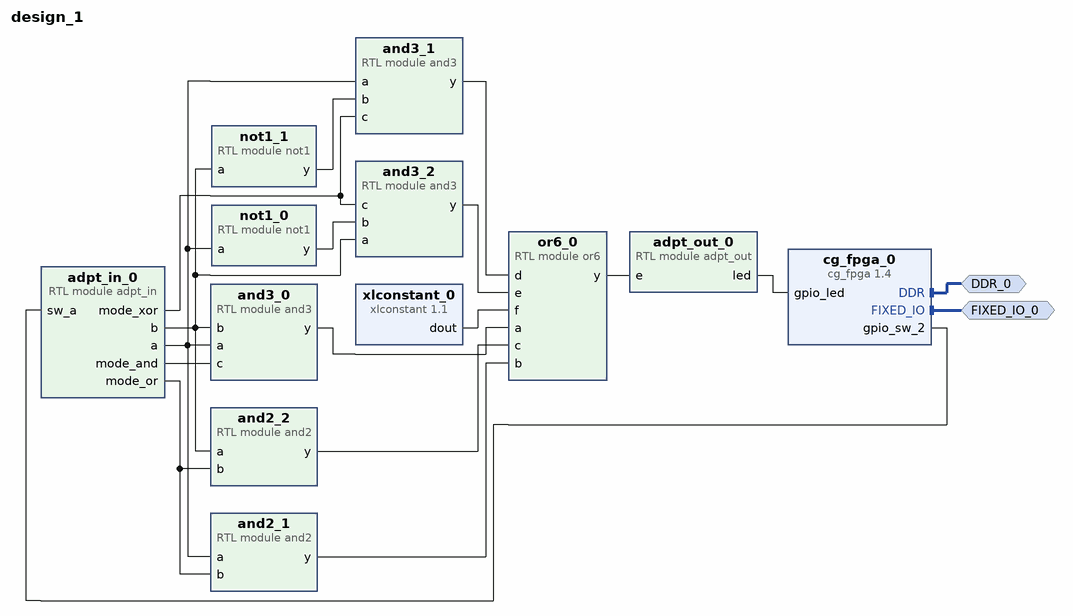
[diagram p0: block diagram of the top level]
# Vivado block design design_1, xc7z020clg400-1, Vivado 2025.2
create_bd_design design_1

create_bd_intf_port -mode Master -vlnv xilinx.com:display_processing_system7:fixedio_rtl:1.0 FIXED_IO_0
create_bd_intf_port -mode Master -vlnv xilinx.com:interface:ddrx_rtl:1.0 DDR_0

create_bd_cell -type ip -vlnv educg.net:user:cg_fpga:1.4 cg_fpga_0
create_bd_cell -type module -reference adpt_in adpt_in_0
create_bd_cell -type module -reference not1 not1_0
create_bd_cell -type module -reference not1 not1_1
create_bd_cell -type module -reference and2 and2_1
create_bd_cell -type module -reference and2 and2_2
create_bd_cell -type module -reference or6 or6_0
create_bd_cell -type module -reference adpt_out adpt_out_0
create_bd_cell -type module -reference and3 and3_0
create_bd_cell -type module -reference and3 and3_1
create_bd_cell -type module -reference and3 and3_2
create_bd_cell -type ip -vlnv xilinx.com:ip:xlconstant:1.1 xlconstant_0
set_property -dict {CONFIG.CONST_VAL 0} [get_bd_cells xlconstant_0]

# ---- connections ----

connect_bd_intf_net [get_bd_intf_ports DDR_0] [get_bd_intf_pins cg_fpga_0/DDR]
connect_bd_intf_net [get_bd_intf_ports FIXED_IO_0] [get_bd_intf_pins cg_fpga_0/FIXED_IO]
connect_bd_net [get_bd_pins adpt_in_0/a] [get_bd_pins not1_0/a] [get_bd_pins and3_0/a] [get_bd_pins and2_1/a] [get_bd_pins and3_1/a]
connect_bd_net [get_bd_pins adpt_in_0/b] [get_bd_pins not1_1/a] [get_bd_pins and2_2/a] [get_bd_pins and3_0/b] [get_bd_pins and3_2/a]
connect_bd_net [get_bd_pins adpt_in_0/mode_and] [get_bd_pins and3_0/c]
connect_bd_net [get_bd_pins adpt_in_0/mode_or] [get_bd_pins and2_2/b] [get_bd_pins and2_1/b]
connect_bd_net [get_bd_pins adpt_in_0/mode_xor] [get_bd_pins and3_1/c] [get_bd_pins and3_2/c]
connect_bd_net [get_bd_pins adpt_out_0/led] [get_bd_pins cg_fpga_0/gpio_led]
connect_bd_net [get_bd_pins and2_1/y] [get_bd_pins or6_0/b]
connect_bd_net [get_bd_pins and2_2/y] [get_bd_pins or6_0/c]
connect_bd_net [get_bd_pins and3_0/y] [get_bd_pins or6_0/a]
connect_bd_net [get_bd_pins and3_1/y] [get_bd_pins or6_0/d]
connect_bd_net [get_bd_pins and3_2/y] [get_bd_pins or6_0/e]
connect_bd_net [get_bd_pins cg_fpga_0/gpio_sw_2] [get_bd_pins adpt_in_0/sw_a]
connect_bd_net [get_bd_pins not1_0/y] [get_bd_pins and3_2/b]
connect_bd_net [get_bd_pins not1_1/y] [get_bd_pins and3_1/b]
connect_bd_net [get_bd_pins or6_0/y] [get_bd_pins adpt_out_0/e]
connect_bd_net [get_bd_pins xlconstant_0/dout] [get_bd_pins or6_0/f]

validate_bd_design
save_bd_design
